# Altium schematic sheet MCU_Powers.SchDoc
size A; SheetNumber: 4
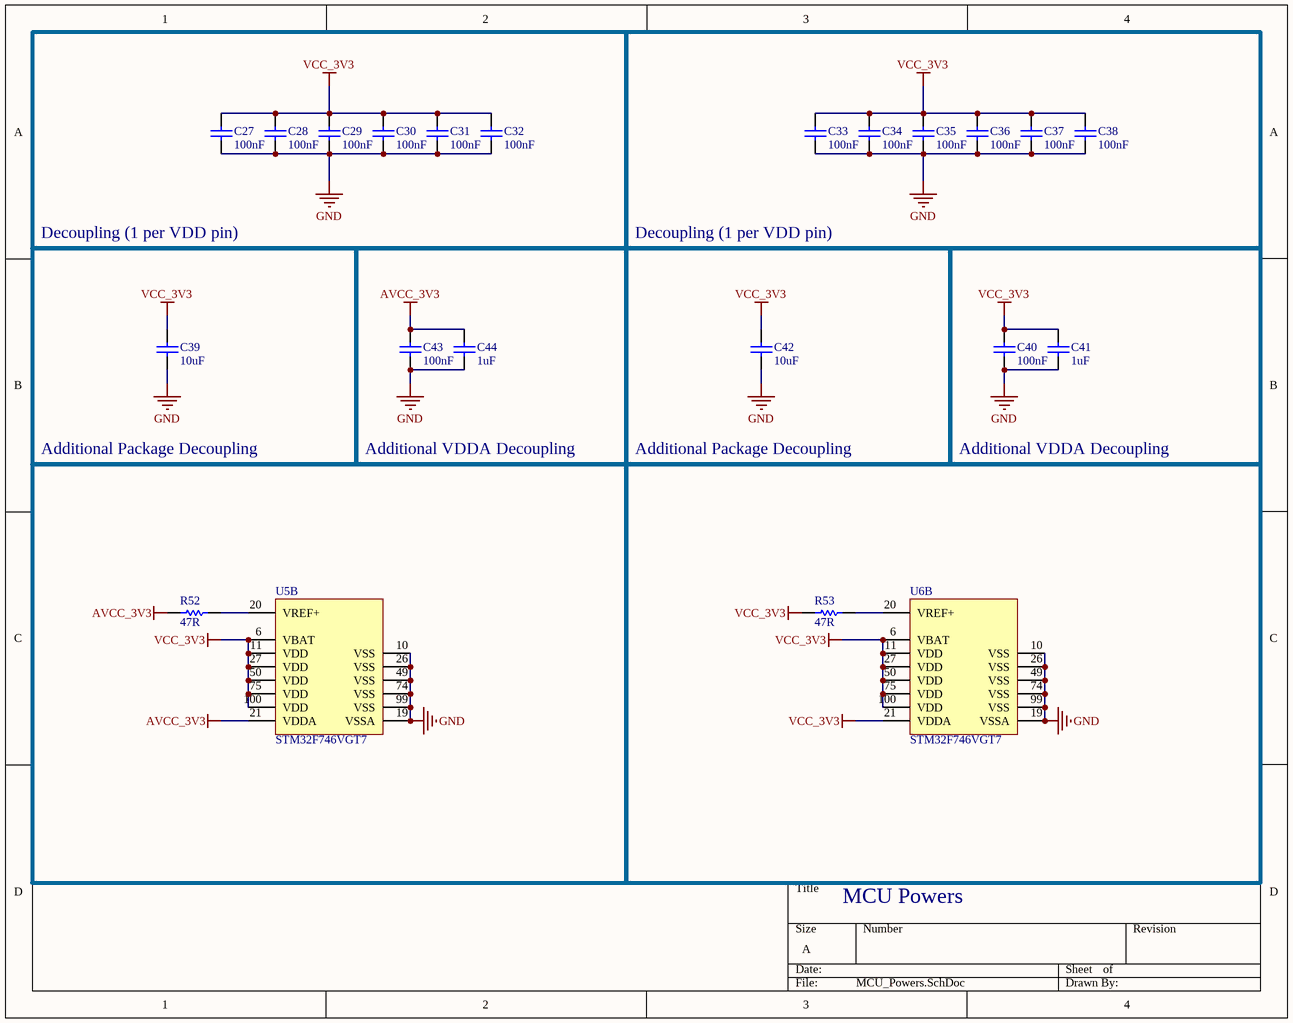
[diagram p0: MCU_Powers.SchDoc]

## Parts
C27  100nF  [CAPC0603(1608)100_N]
C28  100nF  [CAPC0603(1608)100_N]
C29  100nF  [CAPC0603(1608)100_N]
C30  100nF  [CAPC0603(1608)100_N]
C31  100nF  [CAPC0603(1608)100_N]
C32  100nF  [CAPC0603(1608)100_N]
C33  100nF  [CAPC0603(1608)100_N]
C34  100nF  [CAPC0603(1608)100_N]
C35  100nF  [CAPC0603(1608)100_N]
C36  100nF  [CAPC0603(1608)100_N]
C37  100nF  [CAPC0603(1608)100_N]
C38  100nF  [CAPC0603(1608)100_N]
C39  10uF  [CAPC0603(1608)100_N]
C40  100nF  [CAPC0603(1608)100_N]
C41  1uF  [CAPC0603(1608)100_N]
C42  10uF  [CAPC0603(1608)100_N]
C43  100nF  [CAPC0603(1608)100_N]
C44  1uF  [CAPC0603(1608)100_N]
R52  47R  [RESC0603(1608)_N]
R53  47R  [RESC0603(1608)_N]
U5  STM32F746VGT7  [STM-LQFP100_L]  (part B of 2)
U6  STM32F746VGT7  [STM-LQFP100_L]  (part B of 2)

## Blocks framed on the sheet
Decoupling (1 per VDD pin): C27-C32
Decoupling (1 per VDD pin): C33-C38
Additional VDDA Decoupling: C43 C44
Additional VDDA Decoupling: C40 C41
Additional Package Decoupling: R52 U5
Additional Package Decoupling: R53 U6

## Nets
AVCC_3V3: C43.2 C44.2 R52.1 U5.21(VDDA)
GND: C27.1 C28.1 C29.1 C30.1 C31.1 C32.1 C33.1 C34.1 C35.1 C36.1 C37.1 C38.1 C39.1 C40.1 C41.1 C42.1 C43.1 C44.1 U5.10(VSS) U5.19(VSSA) U5.26(VSS) U5.49(VSS) U5.74(VSS) U5.99(VSS) U6.10(VSS) U6.19(VSSA) U6.26(VSS) U6.49(VSS) U6.74(VSS) U6.99(VSS)
VCC_3V3: C27.2 C28.2 C29.2 C30.2 C31.2 C32.2 C33.2 C34.2 C35.2 C36.2 C37.2 C38.2 C39.2 C40.2 C41.2 C42.2 R53.1 U5.6(VBAT) U5.11(VDD) U5.27(VDD) U5.50(VDD) U5.75(VDD) U5.100(VDD) U6.6(VBAT) U6.11(VDD) U6.21(VDDA) U6.27(VDD) U6.50(VDD) U6.75(VDD) U6.100(VDD)
NetR52_2: R52.2 U5.20(VREF+)
NetR53_2: R53.2 U6.20(VREF+)

## Notes on the sheet
- MCU Powers

## Library data of the parts
C27-C38 C40 C43 = CMP-1035-02580-1: CAP 100nF 10V ±10% 0603 (1608 Metric) Thickness 1mm SMD; Tolerance: Â±10%; Case-EIA: 0603; Case-Metric: 1608; Max Thickness: 1 mm; Value: 100nF; Rated Voltage: 10 V; Technology: SMT
C39 C42 = CMP-1035-02799-1: CAP 10uF 10V ±10% 0603 (1608 Metric) Thickness 1mm SMD; Tolerance: Â±10%; Case-Metric: 1608; Case-EIA: 0603; Max Thickness: 1 mm; Technology: SMT; Rated Voltage: 10 V; Value: 10uF
C41 C44 = CMP-1035-02733-1: CAP 1uF 10V ±10% 0603 (1608 Metric) Thickness 1mm SMD; Tolerance: Â±10%; Case-EIA: 0603; Case-Metric: 1608; Rated Voltage: 10 V; Max Thickness: 1 mm; Value: 1uF; Technology: SMT
R52 R53 = CMP-1012-00360-1: 47R 0.1W 1% 0603 (1608 Metric)  SMD; Case-EIA: 0603; Case-Metric: 1608; Value: 47.00 Ohm; Power: 0.1 W; Technology: SMT; Tolerance: 1 %
U5 U6 = CMP-1572-00044-1: ARM Cortex-M4 32-bit MCU+FPU, 1024 KB Flash, 320 KB Internal RAM, 82 I/Os, 100-Pin LQFP, -40 to 105 degC, Tray; FLASH Size (Prog) (kB): 1024; Internal RAM Size (kB): 320; I/Os (High Current): 82; Core: ARM Cortex-M7; Operating Frequency(F) (Processor speed) (MHz): 216; D/A Converter: 2; Supply Voltage(Vcc) min (V): 1.7; ComponentLink2Description: Datasheet; Package Reference: LQFP100; ComponentLink1URL: http://www.st.com/; Mounting Technology: Surface Mount; DatasheetVersion: Rev. 2; Package Description: 100-Pin Low Profile Quad Flat Package, Body 14 x 14 mm, Pitch 0.5 mm; ComponentLink1Description: Manufacturer URL; ComponentLink2URL: http://www.st.com/st-web-ui/static/active/en/resource/technical/document/datasheet/DM00166116.pdf; Packing: Tray